# EAGLE schematic EEZ DIB DCP405 r1B1 (EAGLE 7.2.0)
Assembly variants: Farnell, TME

## Sheet 1 of 6: Power pre-regulator
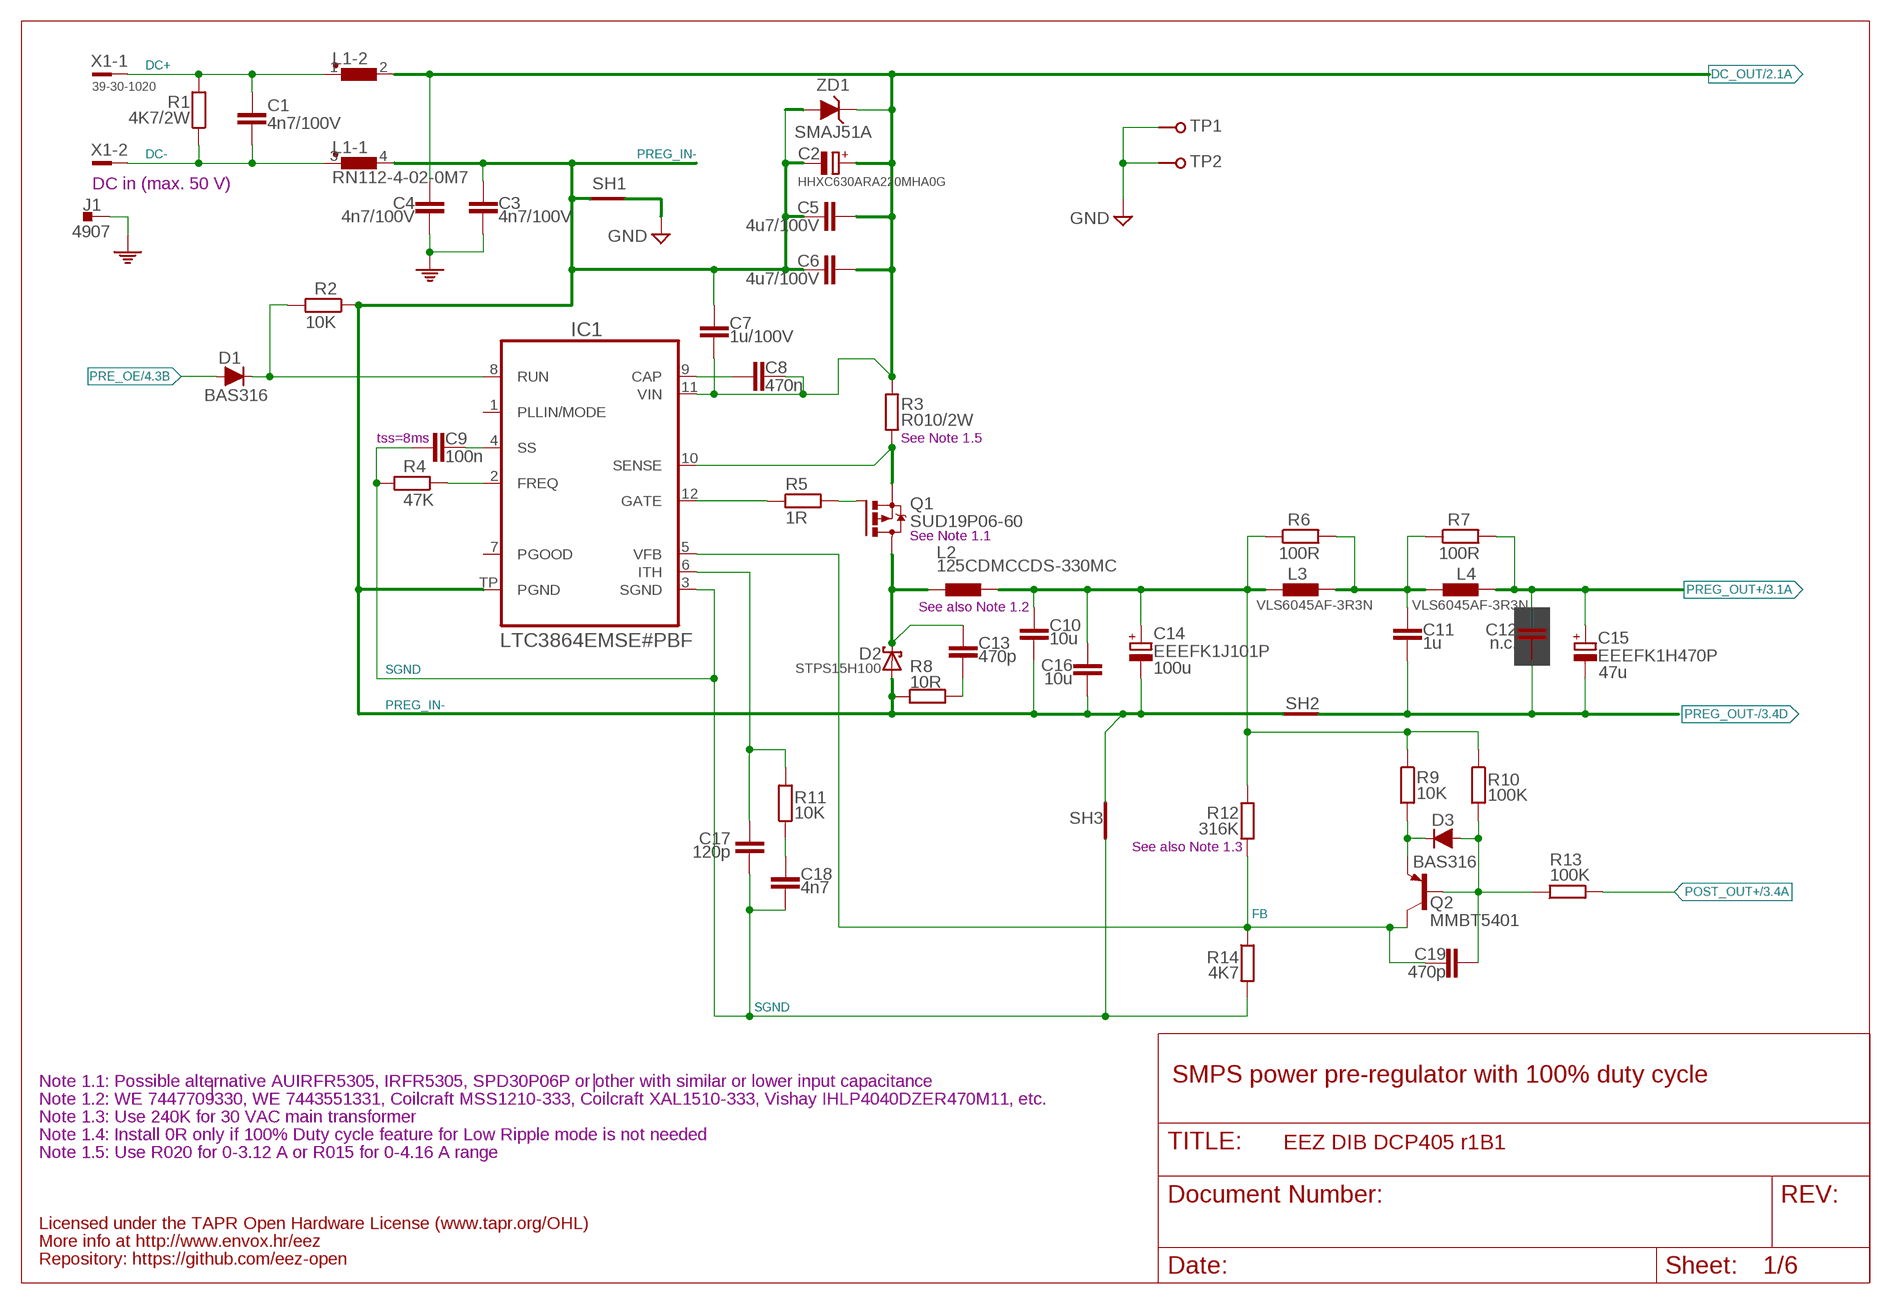
[diagram p0: schematic, sheet 1]

### Parts
C1  4n7/100V  C-EUC1206  [C1206]
C2  HHXC630ARA220MHA0G  ECAPSMD8.3MM/HA0  [CAPAE830X1050N]
C3  4n7/100V  C-EUC1206  [C1206]
C4  4n7/100V  C-EUC1206  [C1206]
C5  4u7/100V  C-EUC1210  [C1210]
C6  4u7/100V  C-EUC1210  [C1210]
C7  1u/100V  C-EUC1206  [C1206]
C8  470n  C-EUC0805  [C0805]
C9  100n  C-EUC0603  [C0603]
C10  10u  C-EUC1210  [C1210]
C11  1u  C-EUC0805  [C0805]
C12  n.c.  C-EUC0805  [C0805]
C13  470p  C-EUC0805  [C0805]
C14  EEEFK1J101P  ECAP10X10  [CAPAE1030X1050N]
C15  EEEFK1H470P  ECAPSMD8.3MM/HA0  [CAPAE830X1050N]
C16  10u  C-EUC1210  [C1210]
C17  120p  C-EUC0805  [C0805]
C18  4n7  C-EUC0805  [C0805]
C19  470p  C-EUC0805  [C0805]
D1  BAS316  DIODESOD323R  [SOD323-R]
D2  STPS15H100  SCHOTTKY-DUAL_A_L  [TO252-L]
D3  BAS316  DIODESOD323R  [SOD323-R]
IC1  LTC3864EMSE#PBF  LTC3864  [LTC_05-08-1666]
J1  4907  PCB_TAB-4907  [PCB_TAB-4907]
L1  RN112-4-02-0M7  RN112  [RN112]
L2  125CDMCCDS-330MC  125CDMCC/DS  [125CDMCC/DS]
L3  VLS6045AF-3R3N  COILCRAFT_HPI0630  [COILCRAFT_HPI0630]
L4  VLS6045AF-3R3N  COILCRAFT_HPI0630  [COILCRAFT_HPI0630]
Q1  SUD19P06-60  P-MOSFETDPAK  [TO229P990X239-3N]
Q2  MMBT5401  BC857B-PNP-SOT23-BEC  [SOT23-BEC]
R1  4K7/2W  R-EU_R2512  [R2512]
R2  10K  R-EU_R0805  [R0805]
R3  R010/2W  R-EU_R2512  [R2512]
R4  47K  R-EU_R0805  [R0805]
R5  1R  R-EU_R0805  [R0805]
R6  100R  R-EU_R0805  [R0805]
R7  100R  R-EU_R0805  [R0805]
R8  10R  R-EU_R1206  [R1206]
R9  10K  R-EU_R0805  [R0805]
R10  100K  R-EU_R0805  [R0805]
R11  10K  R-EU_R0805  [R0805]
R12  316K  R-EU_R0805  [R0805]
R13  100K  R-EU_R0805  [R0805]
R14  4K7  R-EU_R0805  [R0805]
SH1  SHORTNOHOLE  [SHORT_NOHOLE]
SH2  Pgnd to Pout- short  SHORTNOHOLE  [SHORT_NOHOLE]
SH3  Sgnd to Pgnd short  SHORTNOHOLE  [SHORT_NOHOLE]
TP1  PCB_TEST_TABSHIELD  [PCB_SHIELD_TAB]
TP2  PCB_TEST_TABSHIELD  [PCB_SHIELD_TAB]
X1  39-30-1020  MINIFIT_39301020  [MINIFIT_39301020]
ZD1  SMAJ51A  P6SMB68A  [DO214AA]

### Nets
DC+: C1.2 L1.1 R1.2 X1.1
DC-: C1.1 L1.3 R1.1 X1.2
DC_OUT: C2.+ C4.2 C5.1 C6.1 C7.1 C8.2 IC1.11(VIN) L1.2 R3.1 ZD1.C ; also sheet 2,3
FB: C19.1 IC1.5(VFB) Q2.C R12.2 R14.1
GND: SH1.2(GND_B) TP1.1 TP2.1 ; also sheet 2,3,4,5,6
L_OUT: C10.1 C14.+ C16.1 L2.2 L3.1 R6.1 R9.1 R10.1 R12.1
N$1: D3.C Q2.E R9.2
N$2: C18.1 R11.1
N$7: D1.C IC1.8(RUN) R2.2
N$8: C17.1 IC1.6(ITH) R11.2
N$23: C8.1 IC1.9(CAP)
N$24: IC1.2(FREQ) R4.1
N$27: C9.2 IC1.4(SS)
N$28: Q1.1(G) R5.2
N$30: IC1.12(GATE) R5.1
N$35: C11.1 L3.2 L4.1 R6.2 R7.1
N$38: C13.2 R8.2
N$79: C19.2 D3.A Q2.B R10.2 R13.1
PE: C3.2 C4.1 J1.1 J1.2 ; also sheet 6
POST_OUT+: R13.2 ; also sheet 3,6
PRE_OE: D1.A ; also sheet 4
PREG_IN-: C2.- C3.1 C5.2 C6.2 C7.2 C10.2 C14.- C16.2 D2.1(A) D2.2(A) IC1.TP(PGND) L1.4 R2.1 R8.1 SH1.1(GND_A) SH2.2(GND_B) SH3.2(GND_B) ZD1.A
PREG_OUT+: C12.1 C15.+ L4.2 R7.2 ; also sheet 3
PREG_OUT-: C11.2 C12.2 C15.- SH2.1(GND_A) ; also sheet 3,5
SENSE: IC1.10(SENSE) Q1.3(S) R3.2
SGND: C9.1 C17.2 C18.2 IC1.3(SGND) R4.2 R14.2 SH3.1(GND_A)
SW: C13.1 D2.3(C) L2.1 Q1.2(D)
Unconnected: IC1.1(PLLIN/MODE) IC1.7(PGOOD)

### Notes on the sheet
- DC in (max. 50 V)
- tss=8ms | See Note 1.5
- See Note 1.1
- See also Note 1.2
- 100u | 47u
- See also Note 1.3
- Note 1.1: Possible alternative AUIRFR5305, IRFR5305, SPD30P06P or other with similar or lower input capacitance | SMPS power pre-regulator with 100% duty cycle
- Note 1.2: WE 7447709330, WE 7443551331, Coilcraft MSS1210-333, Coilcraft XAL1510-333, Vishay IHLP4040DZER470M11, etc.
- Note 1.3: Use 240K for 30 VAC main transformer
- Note 1.4: Install 0R only if 100% Duty cycle feature for Low Ripple mode is not needed
- Note 1.5: Use R020 for 0-3.12 A or R015 for 0-4.16 A range
- Licensed under the TAPR Open Hardware License (www.tapr.org/OHL)
- More info at http://www.envox.hr/eez
- Repository: https://github.com/eez-open

## Sheet 2 of 6: Bias power, DIB interface
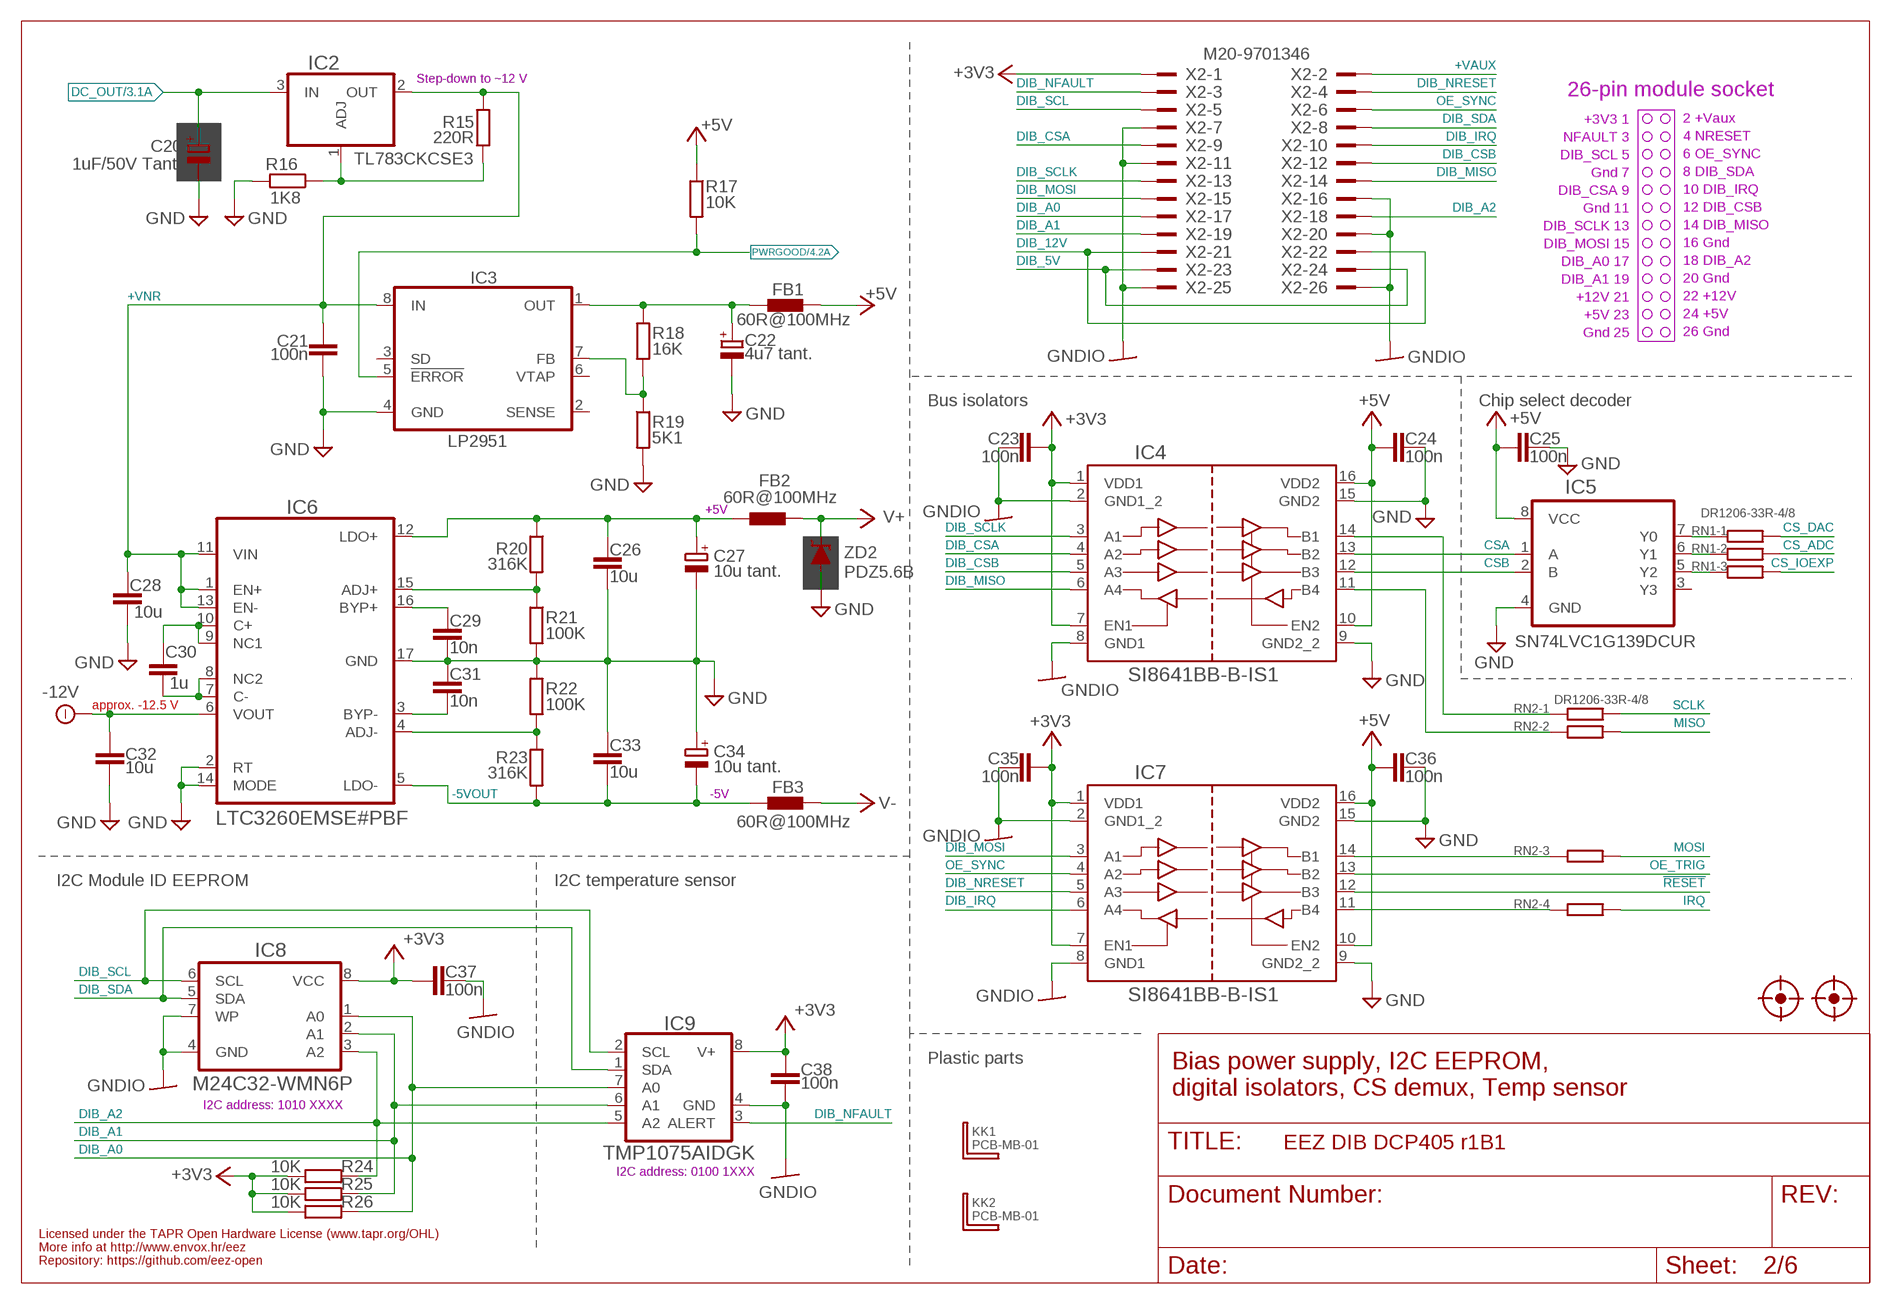
[diagram p1: schematic, sheet 2]

### Parts
C20  1uF/50V Tant.  CPOL-EUC/6032-28R  [C/6032-28R]
C21  100n  C-EUC0603  [C0603]
C22  4u7 tant.  ECAP1206  [EC1206]
C23  100n  C-EUC0603  [C0603]
C24  100n  C-EUC0603  [C0603]
C25  100n  C-EUC0603  [C0603]
C26  10u  C-EUC1210  [C1210]  (variant Farnell: 2320829)  (variant TME: CL21B225KAFNNNG )
C27  10u tant.  ECAP1206  [EC1206]
C28  10u  C-EUC1210  [C1210]
C29  10n  C-EUC0805  [C0805]
C30  1u  C-EUC0805  [C0805]
C31  10n  C-EUC0805  [C0805]
C32  10u  C-EUC1210  [C1210]
C33  10u  C-EUC1210  [C1210]
C34  10u tant.  ECAP1206  [EC1206]
C35  100n  C-EUC0603  [C0603]
C36  100n  C-EUC0603  [C0603]
C37  100n  C-EUC0603  [C0603]
C38  100n  C-EUC0603  [C0603]
FB1  60R@100MHz  FERRITE_BEAD0603  [BEAD0603]
FB2  60R@100MHz  FERRITE_BEAD0603  [BEAD0603]
FB3  60R@100MHz  FERRITE_BEAD0603  [BEAD0603]
FM1  FIDUCIAL_2  [FIDUCIAL_DUAL]
FM2  FIDUCIAL_2  [FIDUCIAL_DUAL]
IC2  TL783CKCSE3  [TO220H-CLR2]
IC3  LP2951  LP2951SO8  [SOIC127P600X175-8N]
IC4  SI8641BB-B-IS1  SI8641NSOIC-16  [SOIC-16]
IC5  SN74LVC1G139DCUR  SN74LVC1G139-VSSOP  [DCU8]
IC6  LTC3260EMSE#PBF  LTC3260MSOP16  [SOP50P490X110-17N]
IC7  SI8641BB-B-IS1  SI8641NSOIC-16  [SOIC-16]
IC8  M24C32-WMN6P  AT24CXXSOIC8  [SOIC127P600X173-8N]
IC9  TMP1075AIDGK  TMPX75DGK  [DGK8]
KK1  PCB-MB-01  PCB-MB  [PCB-MB]
KK2  PCB-MB-01  PCB-MB  [PCB-MB]
R15  220R  R-EU_R0805  [R0805]
R16  1K8  R-EU_R0805  [R0805]
R17  10K  R-EU_R0805  [R0805]
R18  16K  R-EU_R0805  [R0805]
R19  5K1  R-EU_R0805  [R0805]
R20  316K  R-EU_R0805  [R0805]
R21  100K  R-EU_R0805  [R0805]
R22  100K  R-EU_R0805  [R0805]
R23  316K  R-EU_R0805  [R0805]
R24  10K  R-EU_R0805  [R0805]
R25  10K  R-EU_R0805  [R0805]
R26  10K  R-EU_R0805  [R0805]
RN1  DR1206-33R-4/8  R_ARRAY4  [CAY16]
RN2  DR1206-33R-4/8  R_ARRAY4  [CAY16]
X2  M20-9701346  [M20-9701346]
ZD2  PDZ5.6B  ZENER-DIODESOD323  [SOD323-W]

### Nets
!RESET: IC7.12(B3) ; also sheet 4
+3V3: C23.1 C35.1 C37.2 C38.1 IC4.1(VDD1) IC4.7(EN1) IC7.1(VDD1) IC7.7(EN1) IC8.8(VCC) IC9.8(V+) R24.1 R25.1 R26.1 X2.1
+5V: C24.2 C25.1 C36.2 FB1.P$2 IC4.10(EN2) IC4.16(VDD2) IC5.8(VCC) IC7.10(EN2) IC7.16(VDD2) R17.1 ; also sheet 3,4,5,6
+5VOUT: C26.1 C27.+ FB2.P$1 IC6.12(LDO+) R20.1
+VAUX: X2.2
+VNR: C21.1 C28.1 IC2.2(OUT) IC3.8(IN) IC6.1(EN+) IC6.11(VIN) IC6.13(EN-) R15.1
-5VOUT: C33.2 C34.- FB3.P$1 IC6.5(LDO-) R23.2
-12V: C32.1 IC6.6(VOUT) ; also sheet 3
CS_ADC: RN1.7 ; also sheet 4
CS_DAC: RN1.8 ; also sheet 4
CS_IOEXP: RN1.6 ; also sheet 4
CSA: IC4.13(B2) IC5.1(A)
CSB: IC4.12(B3) IC5.2(B)
DC_OUT: C20.+ IC2.3(IN) ; also sheet 1,3
DIB_5V: X2.23 X2.24
DIB_12V: X2.21 X2.22
DIB_A0: IC8.1(A0) IC9.7(A0) R26.2 X2.17
DIB_A1: IC8.2(A1) IC9.6(A1) R25.2 X2.19
DIB_A2: IC8.3(A2) IC9.5(A2) R24.2 X2.18
DIB_CSA: IC4.4(A2) X2.9
DIB_CSB: IC4.5(A3) X2.12
DIB_IRQ: IC7.6(A4) X2.10
DIB_MISO: IC4.6(A4) X2.14
DIB_MOSI: IC7.3(A1) X2.15
DIB_NFAULT: IC9.3(ALERT) X2.3
DIB_NRESET: IC7.5(A3) X2.4
DIB_SCL: IC8.6(SCL) IC9.2(SCL) X2.5
DIB_SCLK: IC4.3(A1) X2.13
DIB_SDA: IC8.5(SDA) IC9.1(SDA) X2.8
GND: C20.- C21.2 C22.- C24.1 C25.2 C26.2 C27.- C28.2 C29.1 C31.1 C32.2 C33.1 C34.+ C36.1 IC3.4(GND) IC4.9(GND2_2) IC4.15(GND2) IC5.4(GND) IC6.2(RT) IC6.14(MODE) IC6.17(GND) IC7.9(GND2_2) IC7.15(GND2) R16.2 R19.2 R21.2 R22.1 ZD2.A ; also sheet 1,3,4,5,6
GNDIO: C23.2 C35.2 C37.1 C38.2 IC4.2(GND1_2) IC4.8(GND1) IC7.2(GND1_2) IC7.8(GND1) IC8.4(GND) IC8.7(WP) IC9.4(GND) X2.7 X2.11 X2.16 X2.20 X2.25 X2.26
IRQ: RN2.5 ; also sheet 4
MISO: RN2.7 ; also sheet 4
MOSI: RN2.6 ; also sheet 4
N$4: IC5.5(Y2) RN1.3
N$6: IC5.7(Y0) RN1.1
N$9: IC4.11(B4) RN2.2
N$10: IC7.11(B4) RN2.4
N$22: IC5.6(Y1) RN1.2
N$39: IC6.15(ADJ+) R20.2 R21.1
N$40: C30.1 IC6.9(NC1) IC6.10(C+)
N$43: C30.2 IC6.7(C-) IC6.8(NC2)
N$52: C29.2 IC6.16(BYP+)
N$57: IC6.4(ADJ-) R22.2 R23.1
N$58: C31.2 IC6.3(BYP-)
N$61: IC7.14(B1) RN2.3
N$63: IC3.7(FB) R18.2 R19.1
N$122: IC4.14(B1) RN2.1
N$167: C22.+ FB1.P$1 IC3.1(OUT) R18.1
OE_SYNC: IC7.4(A2) X2.6
OE_TRIG: IC7.13(B2) ; also sheet 4
PWRGOOD: IC3.5(!ERROR) R17.2 ; also sheet 4
SCLK: RN2.8 ; also sheet 4
TL783_ADJ: IC2.1(ADJ) R15.2 R16.1
V+: FB2.P$2 ZD2.C ; also sheet 3,4,5
V-: FB3.P$2 ; also sheet 3,5
Unconnected: IC3.2(SENSE) IC3.3(SD) IC3.6(VTAP) IC5.3(Y3) RN1.4 RN1.5

### Notes on the sheet
- Step-down to ~12 V
- 26-pin module socket
- +3V3 1
- 2 +Vaux
- NFAULT 3
- 4 NRESET
- DIB_SCL 5
- 6 OE_SYNC
- Gnd 7
- 8 DIB_SDA
- DIB_CSA 9
- 10 DIB_IRQ
- Gnd 11
- 12 DIB_CSB
- DIB_SCLK 13
- 14 DIB_MISO
- DIB_MOSI 15
- 16 Gnd
- DIB_A0 17
- 18 DIB_A2
- DIB_A1 19
- 20 Gnd
- +12V 21
- 22 +12V
- +5V 23
- 24 +5V
- Gnd 25
- 26 Gnd
- Bus isolators | Chip select decoder
- +5V
- approx. -12.5 V
- -5V
- I2C Module ID EEPROM | I2C temperature sensor
- Plastic parts
- Bias power supply, I2C EEPROM,
  digital isolators, CS demux, Temp sensor
- I2C address: 1010 XXXX
- I2C address: 0100 1XXX
- Licensed under the TAPR Open Hardware License (www.tapr.org/OHL)
- More info at http://www.envox.hr/eez
- Repository: https://github.com/eez-open

## Sheet 3 of 6: Post-regulator
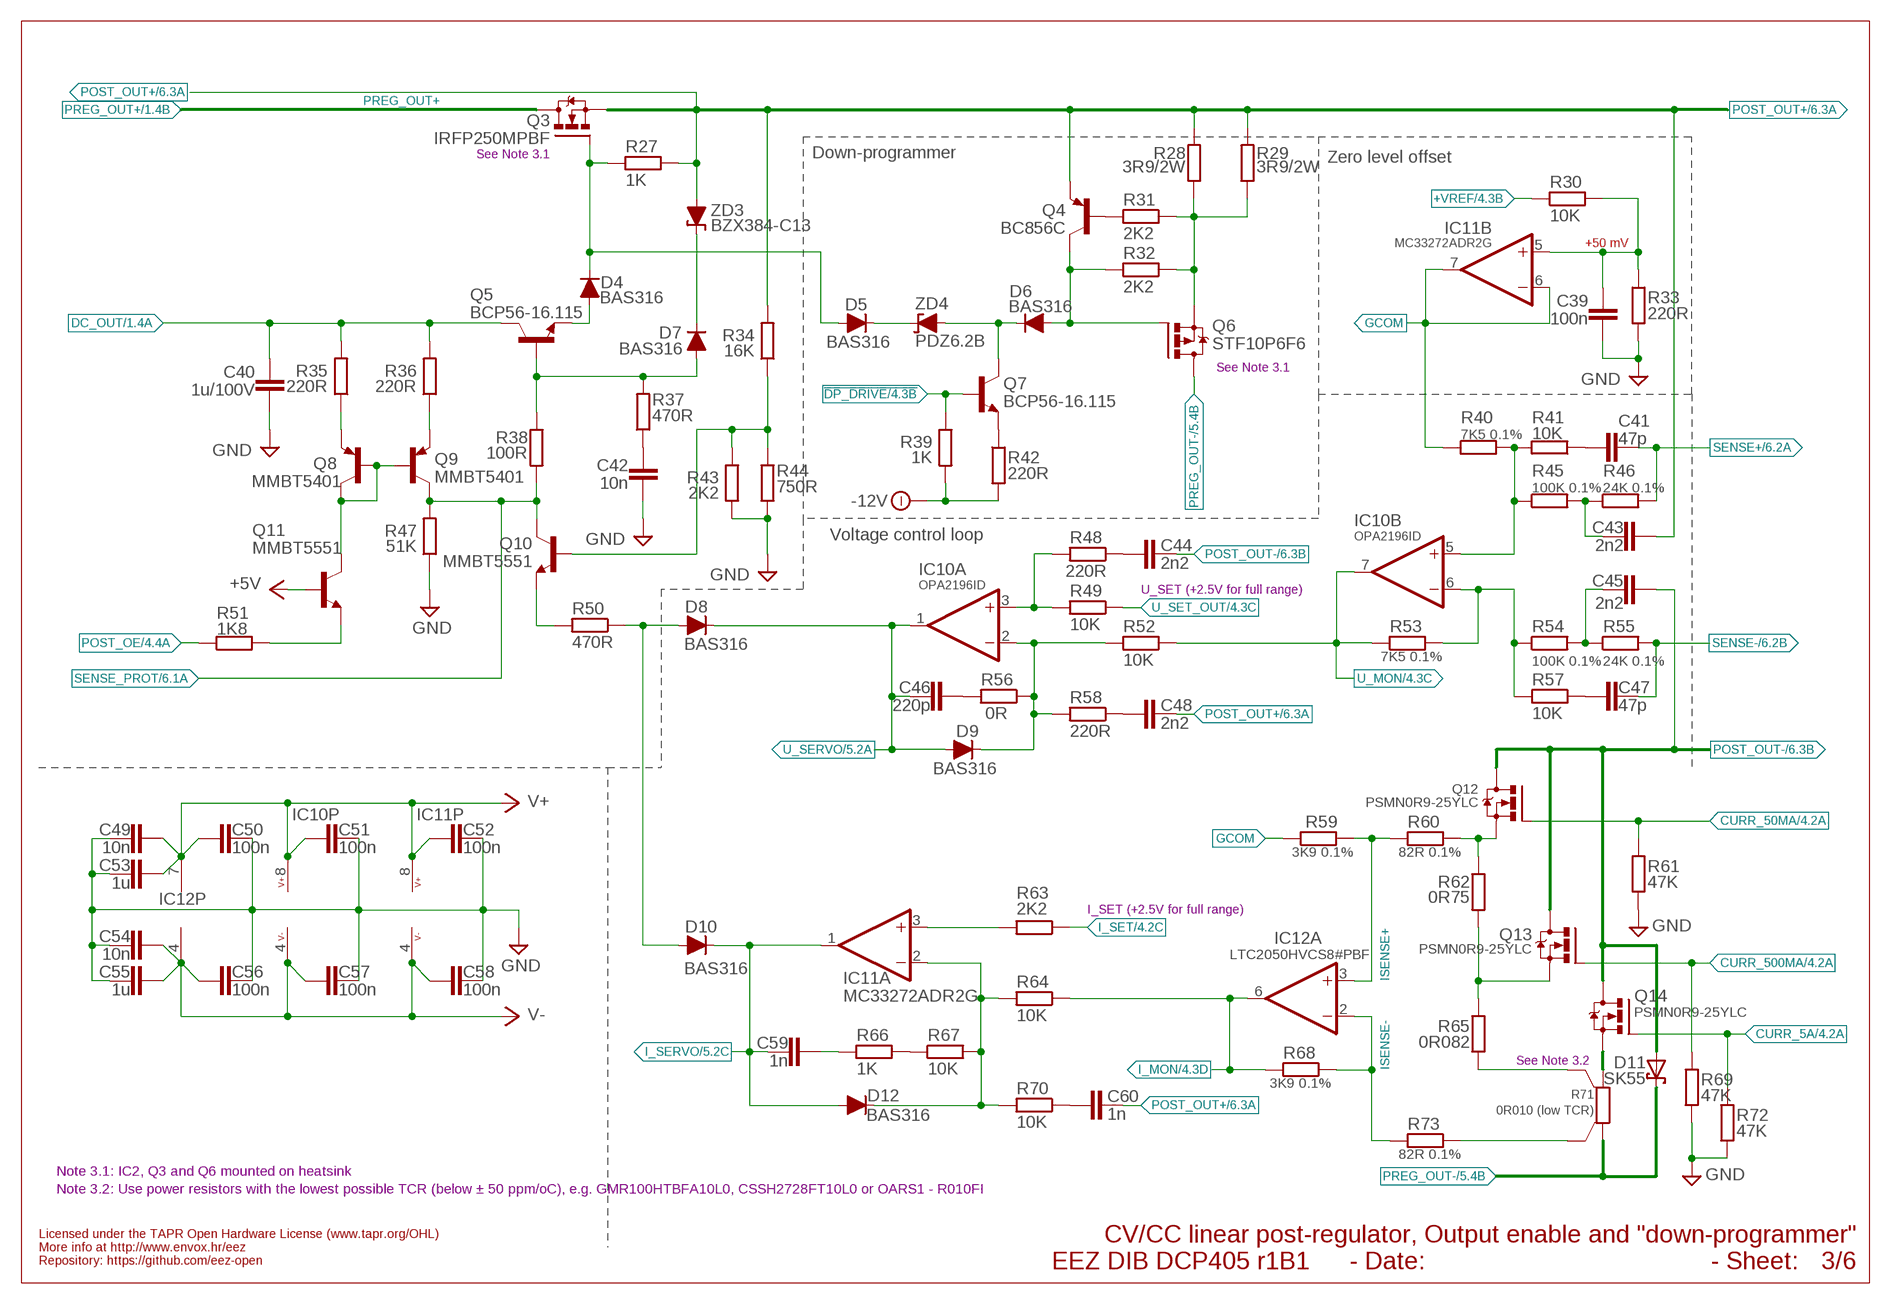
[diagram p2: schematic, sheet 3]

### Parts
C39  100n  C-EUC0603  [C0603]
C40  1u/100V  C-EUC1206  [C1206]
C41  47p  C-EUC0805  [C0805]
C42  10n  C-EUC0805  [C0805]
C43  2n2  C-EUC0805  [C0805]
C44  2n2  C-EUC0805  [C0805]
C45  2n2  C-EUC0805  [C0805]
C46  220p  C-EUC0805  [C0805]
C47  47p  C-EUC0805  [C0805]
C48  2n2  C-EUC0805  [C0805]
C49  10n  C-EUC0805  [C0805]
C50  100n  C-EUC0603  [C0603]
C51  100n  C-EUC0603  [C0603]
C52  100n  C-EUC0603  [C0603]
C53  1u  C-EUC0805  [C0805]
C54  10n  C-EUC0805  [C0805]
C55  1u  C-EUC0805  [C0805]
C56  100n  C-EUC0603  [C0603]
C57  100n  C-EUC0603  [C0603]
C58  100n  C-EUC0603  [C0603]
C59  1n  C-EUC0805  [C0805]
C60  1n  C-EUC0805  [C0805]
D4  BAS316  DIODESOD323R  [SOD323-R]
D5  BAS316  DIODESOD323R  [SOD323-R]
D6  BAS316  DIODESOD323R  [SOD323-R]
D7  BAS316  DIODESOD323R  [SOD323-R]
D8  BAS316  DIODESOD323R  [SOD323-R]
D9  BAS316  DIODESOD323R  [SOD323-R]
D10  BAS316  DIODESOD323R  [SOD323-R]
D11  SK55  SCHOTTKYSMB  [SMB]
D12  BAS316  DIODESOD323R  [SOD323-R]
IC10  OPA2196ID  TL072SOIC8  [SOIC127P600X173-8N]
IC11  MC33272ADR2G  TL072SOIC8  [SOIC127P600X173-8N]
IC12  LTC2050HVCS8#PBF  OP27GSZSO8  [SOIC127P600X173-8N]
Q3  IRFP250MPBF  IRFP240MIRROR2  [TO247BH-CLR2]
Q4  BC856C  BC857C-PNP-SOT23-BEC  [SOT23-BEC]
Q5  BCP56-16.115  BCP56  [SOT230P700X180-4N]
Q6  STF10P6F6  P-MOSFETMIRROR2  [TO220H-CLR2]
Q7  BCP56-16.115  BCP56  [SOT230P700X180-4N]
Q8  MMBT5401  BC857B-PNP-SOT23-BEC  [SOT23-BEC]
Q9  MMBT5401  BC857B-PNP-SOT23-BEC  [SOT23-BEC]
Q10  MMBT5551  MMBT5551LT1-NPN-SOT23-BEC  [SOT23-BEC]
Q11  MMBT5551  MMBT5551LT1-NPN-SOT23-BEC  [SOT23-BEC]
Q12  PSMN0R9-25YLC  N-MOSFETLFPAK  [SOT669]
Q13  PSMN0R9-25YLC  N-MOSFETLFPAK  [SOT669]
Q14  PSMN0R9-25YLC  N-MOSFETLFPAK  [SOT669]
R27  1K  R-EU_R0805  [R0805]
R28  3R9/2W  R-EU_R2512  [R2512]
R29  3R9/2W  R-EU_R2512  [R2512]
R30  10K  R-EU_R0805  [R0805]
R31  2K2  R-EU_R0805  [R0805]
R32  2K2  R-EU_R0805  [R0805]
R33  220R  R-EU_R0805  [R0805]
R34  16K  R-EU_R0805  [R0805]
R35  220R  R-EU_R0805  [R0805]
R36  220R  R-EU_R0805  [R0805]
R37  470R  R-EU_R0805  [R0805]
R38  100R  R-EU_R0805  [R0805]
R39  1K  R-EU_R0805  [R0805]
R40  7K5 0.1%  R-EU_R0805  [R0805]
R41  10K  R-EU_R0805  [R0805]
R42  220R  R-EU_R0805  [R0805]
R43  2K2  R-EU_R0805  [R0805]
R44  750R  R-EU_R0805  [R0805]
R45  100K 0.1%  R-EU_R0805  [R0805]
R46  24K 0.1%  R-EU_R0805  [R0805]
R47  51K  R-EU_R0805  [R0805]
R48  220R  R-EU_R0805  [R0805]
R49  10K  R-EU_R0805  [R0805]
R50  470R  R-EU_R0805  [R0805]
R51  1K8  R-EU_R0805  [R0805]
R52  10K  R-EU_R0805  [R0805]
R53  7K5 0.1%  R-EU_R0805  [R0805]
R54  100K 0.1%  R-EU_R0805  [R0805]
R55  24K 0.1%  R-EU_R0805  [R0805]
R56  0R  R-EU_R0805  [R0805]
R57  10K  R-EU_R0805  [R0805]
R58  220R  R-EU_R0805  [R0805]
R59  3K9 0.1%  R-EU_R0805  [R0805]
R60  82R 0.1%  R-EU_R0805  [R0805]
R61  47K  R-EU_R0805  [R0805]
R62  0R75  R-EU_R1206  [R1206]
R63  2K2  R-EU_R0805  [R0805]
R64  10K  R-EU_R0805  [R0805]
R65  0R082  R-EU_R1210  [R1210]
R66  1K  R-EU_R0805  [R0805]
R67  10K  R-EU_R0805  [R0805]
R68  3K9 0.1%  R-EU_R0805  [R0805]
R69  47K  R-EU_R0805  [R0805]
R70  10K  R-EU_R0805  [R0805]
R71  0R010 (low TCR)  R-EU_4WIREH2728  [R_H2728]
R72  47K  R-EU_R0805  [R0805]
R73  82R 0.1%  R-EU_R0805  [R0805]
ZD3  BZX384-C13  ZENER-DIODESOD323  [SOD323-W]
ZD4  PDZ6.2B  ZENER-DIODESOD323  [SOD323-W]

### Nets
5A_S: Q14.1(S) Q14.2(S) Q14.3(S) R71.2
50MA_S: Q12.1(S) Q12.2(S) Q12.3(S) R60.1 R62.1
500MA_S: Q13.1(S) Q13.2(S) Q13.3(S) R62.2 R65.2
!DP_DRIVE: Q7.1(B) R39.1 ; also sheet 4
+5V: Q11.B ; also sheet 2,4,5,6
+VREF: R30.1 ; also sheet 4
-12V: R39.2 R42.2 ; also sheet 2
CURR_5A: Q14.4(G) R72.2 ; also sheet 4
CURR_50MA: Q12.4(G) R61.2 ; also sheet 4
CURR_500MA: Q13.4(G) R69.2 ; also sheet 4
DC_OUT: C40.1 Q5.2(C) Q5.4(C) R35.2 R36.2 ; also sheet 1,2
DP_S: Q6.3(S) R28.1 R29.1 R31.1 R32.1
GCOM: IC11.6(B:-IN) IC11.7(B:OUT) R40.1 R59.1
GND: C39.2 C40.2 C42.2 C49.1 C50.2 C51.1 C52.1 C53.1 C54.1 C55.1 C56.2 C57.1 C58.1 R33.2 R43.1 R44.1 R47.1 R61.1 R69.1 R72.1 ; also sheet 1,2,4,5,6
I_MON: IC12.6(A:OUT) R64.1 R68.2 ; also sheet 4
I_SERVO: C59.2 D10.C D12.A IC11.1(A:OUT) ; also sheet 5
I_SET: R63.1 ; also sheet 4
ISENSE+: IC12.3(A:+IN) R59.2 R60.2
ISENSE-: IC12.2(A:-IN) R68.1 R73.2
LOOP_CTRL: D8.A D10.A R50.1
N$11: R65.1 R71.2S
N$14: C46.1 R56.2
N$82: IC11.3(A:+IN) R63.2
N$83: IC10.3(A:+IN) R48.2 R49.2
N$84: D9.C IC10.2(A:-IN) R52.2 R56.1 R58.2
N$85: C45.1 R54.2 R55.1
N$86: C41.2 R41.1
N$87: C47.2 R57.1
N$88: C60.2 R70.1
N$89: D12.C IC11.2(A:-IN) R64.2 R67.2 R70.2
N$90: C44.2 R48.1
N$91: C48.2 R58.1
N$92: D4.C D5.A Q3.1(G) R27.1
N$93: D4.A Q5.3(E)
N$95: D7.A Q5.1(B) R37.2 R38.1
N$96: C42.1 R37.1
N$97: Q10.B R34.1 R43.2 R44.2
N$98: Q7.3(E) R42.1
N$99: Q4.B R31.2
N$102: C39.1 IC11.5(B:+IN) R30.2 R33.1
N$117: C43.1 R45.2 R46.1
N$129: D7.C ZD3.C
N$143: D5.C ZD4.C
N$145: Q10.E R50.2
N$147: D6.A Q4.C Q6.1(G) R32.2
N$150: IC10.5(B:+IN) R40.2 R41.2 R45.1
N$158: IC10.6(B:-IN) R53.2 R54.1 R57.2
N$160: R66.2 R67.1
N$162: C59.1 R66.1
N$183: Q9.E R36.1
N$184: Q8.E R35.1
N$186: Q11.E R51.2
N$200: R71.1S R73.1
POST_OE: R51.1 ; also sheet 4
POST_OUT+: C43.2 C48.1 C60.1 Q3.3(S) Q4.E R27.2 R28.2 R29.2 R34.2 ZD3.A ; also sheet 1,6
POST_OUT-: C44.1 C45.2 D11.A Q12.MB(D) Q13.MB(D) Q14.MB(D) ; also sheet 6
PREG_OUT+: Q3.2(D) ; also sheet 1
PREG_OUT-: D11.C Q6.2(D) R71.1 ; also sheet 1,5
Q6C: D6.C Q7.2(C) Q7.4(C) ZD4.A
Q7C: Q8.B Q8.C Q9.B Q11.C
SENSE+: C41.1 R46.2 ; also sheet 6
SENSE-: C47.1 R55.2 ; also sheet 6
SENSE_PROT: Q9.C Q10.C R38.2 R47.2 ; also sheet 6
U_MON: IC10.7(B:OUT) R52.1 R53.1 ; also sheet 4,5
U_SERVO: C46.2 D8.C D9.A IC10.1(A:OUT) ; also sheet 5
U_SET_OUT: R49.1 ; also sheet 4
V+: C49.2 C50.1 C51.2 C52.2 C53.2 IC10.8(P:V+) IC11.8(P:V+) IC12.7(P:V+) ; also sheet 2,4,5
V-: C54.2 C55.2 C56.1 C57.2 C58.2 IC10.4(P:V-) IC11.4(P:V-) IC12.4(P:V-) ; also sheet 2,5

### Notes on the sheet
- See Note 3.1
- Down-programmer | Zero level offset
- +50 mV
- See Note 3.1
- Voltage control loop
- U_SET (+2.5V for full range)
- I_SET (+2.5V for full range)
- See Note 3.2
- Note 3.1: IC2, Q3 and Q6 mounted on heatsink
- Note 3.2: Use power resistors with the lowest possible TCR (below ± 50 ppm/oC), e.g. GMR100HTBFA10L0, CSSH2728FT10L0 or OARS1 - R010FI
- Licensed under the TAPR Open Hardware License (www.tapr.org/OHL)
- CV/CC linear post-regulator, Output enable and "down-programmer"
- More info at http://www.envox.hr/eez
- Repository: https://github.com/eez-open
- - Date: | - Sheet:

## Sheet 4 of 6: Digital control, Vref
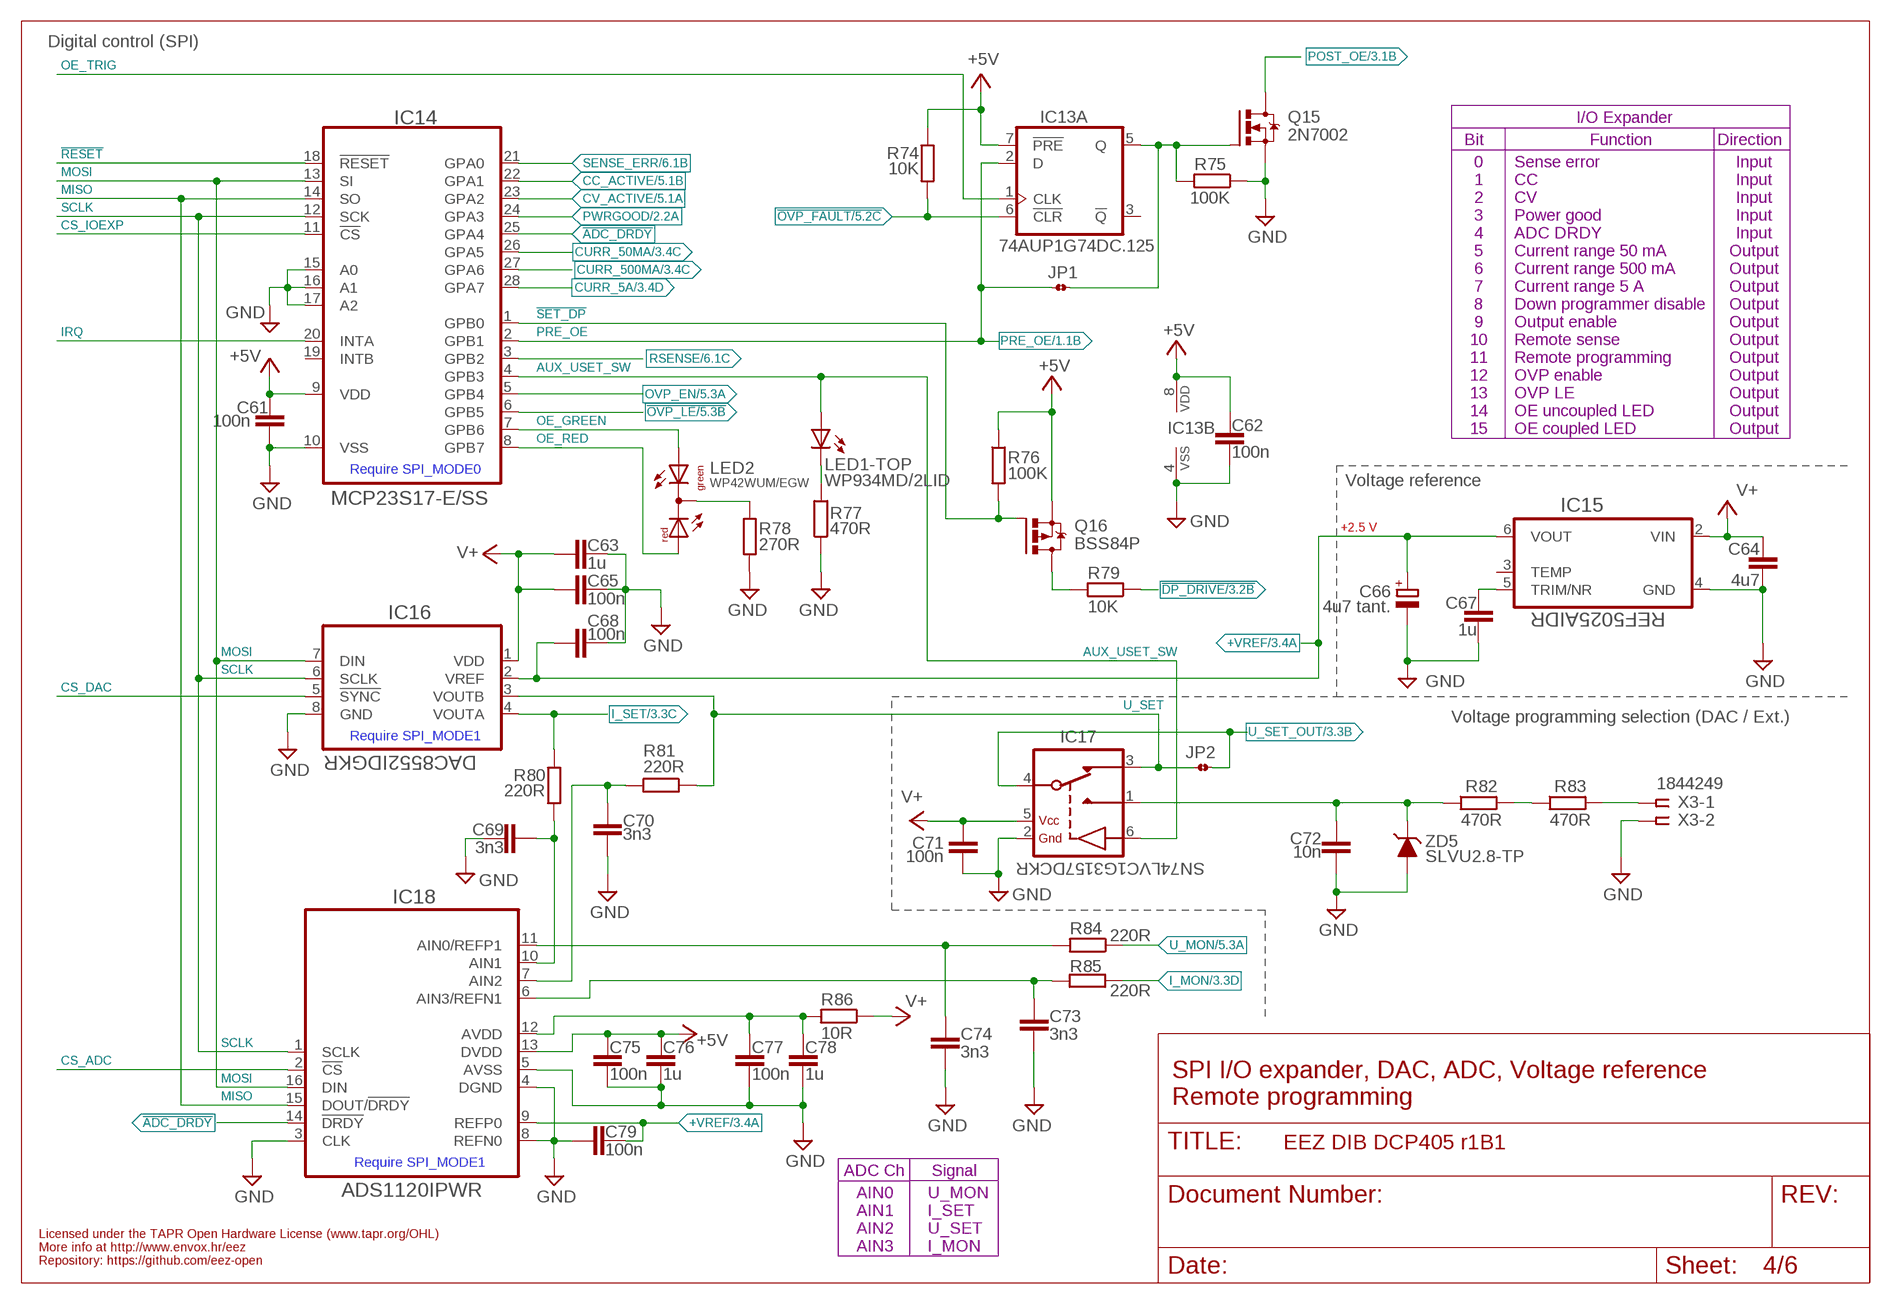
[diagram p3: schematic, sheet 4]

### Parts
C61  100n  C-EUC0603  [C0603]
C62  100n  C-EUC0603  [C0603]
C63  1u  C-EUC0805  [C0805]
C64  4u7  C-EUC1206  [C1206]
C65  100n  C-EUC0603  [C0603]
C66  4u7 tant.  ECAP1206  [EC1206]
C67  1u  C-EUC0805  [C0805]
C68  100n  C-EUC0603  [C0603]
C69  3n3  C-EUC0805  [C0805]
C70  3n3  C-EUC0805  [C0805]
C71  100n  C-EUC0603  [C0603]
C72  10n  C-EUC0805  [C0805]
C73  3n3  C-EUC0805  [C0805]
C74  3n3  C-EUC0805  [C0805]
C75  100n  C-EUC0603  [C0603]
C76  1u  C-EUC0805  [C0805]
C77  100n  C-EUC0603  [C0603]
C78  1u  C-EUC0805  [C0805]
C79  100n  C-EUC0603  [C0603]
IC13  74AUP1G74DC.125  SN74LVC1G74DCTR-VSSOP  [DCU8]
IC14  MCP23S17-E/SS  MCP23S17-E/SSSSOP  [SOP65P780X200-28N]
IC15  REF5025AIDR  REF50XX  [SOIC127P600X175-8N]
IC16  DAC8552IDGKR  DAC8552_DGK_8M  [DGK8-M]
IC17  SN74LVC1G3157DCKR  SN74LVC1G3157-DCK  [SOT65P210X110-6N]
IC18  ADS1120IPWR  ADS1120TSSOP-16  [PW(R-PDSO-G16)]
JP1  JP2-CUT  [JP2-CUT]
JP2  JP2-CUT  [JP2-CUT]
LED1  WP934MD/2LID  [WP934MD]
LED2  WP42WUM/EGW  LED_L-42WUM/1EGWT  [L-42WUM-1EGWT]
Q15  2N7002  [SOT103P240X110-3N]
Q16  BSS84P  IRLML2246TRPBF  [SOT95P237X112-3N]
R74  10K  R-EU_R0805  [R0805]
R75  100K  R-EU_R0805  [R0805]
R76  100K  R-EU_R0805  [R0805]
R77  470R  R-EU_R0805  [R0805]
R78  270R  R-EU_R0805  [R0805]
R79  10K  R-EU_R0805  [R0805]
R80  220R  R-EU_R0805  [R0805]
R81  220R  R-EU_R0805  [R0805]
R82  470R  R-EU_R0805  [R0805]
R83  470R  R-EU_R0805  [R0805]
R84  220R  R-EU_R0805  [R0805]
R85  220R  R-EU_R0805  [R0805]
R86  10R  R-EU_R1206  [R1206]
X3  1844249  MC1,5/5-G-3,5  [MC1,5/5-G-3,5]
ZD5  SLVU2.8-TP  SLVU2.8  [SOT23]

### Nets
!ADC_DRDY: IC14.25(GPA4) IC18.14(!DRDY)
!DP_DRIVE: R79.1 ; also sheet 3
!OVP_FAULT: IC13.6(A:!CLR) R74.2 ; also sheet 5
!OVP_LE: IC14.6(GPB5) ; also sheet 5
!RESET: IC14.18(!RESET) ; also sheet 2
!SET_DP: IC14.1(GPB0) Q16.1(G) R76.2
+5V: C61.1 C62.2 C75.2 C76.2 IC13.7(A:!PRE) IC13.8(B:VDD) IC14.9(VDD) IC18.13(DVDD) Q16.2(S) R74.1 R76.1 ; also sheet 2,3,5,6
+VREF: C66.+ C68.2 C79.2 IC15.6(VOUT) IC16.2(VREF) IC18.9(REFP0) ; also sheet 3
AUX_IN: C72.2 IC17.1(NO) R82.1 ZD5.3(C)
AUX_USET_SW: IC14.4(GPB3) IC17.6(CTRL) LED1.TA(-TOP:A)
CC_ACTIVE: IC14.22(GPA1) ; also sheet 5
CS_ADC: IC18.2(!CS) ; also sheet 2
CS_DAC: IC16.5(!SYNC) ; also sheet 2
CS_IOEXP: IC14.11(!CS) ; also sheet 2
CURR_5A: IC14.28(GPA7) ; also sheet 3
CURR_50MA: IC14.26(GPA5) ; also sheet 3
CURR_500MA: IC14.27(GPA6) ; also sheet 3
CV_ACTIVE: IC14.23(GPA2) ; also sheet 5
DP_LED: Q16.3(D) R79.2
GND: C61.2 C62.1 C63.2 C64.2 C65.1 C66.- C67.2 C68.1 C69.1 C70.1 C71.2 C72.1 C73.2 C74.1 C75.1 C76.1 C77.1 C78.1 C79.1 IC13.4(B:VSS) IC14.10(VSS) IC14.15(A0) IC14.16(A1) IC14.17(A2) IC15.4(GND) IC16.8(GND) IC17.2(GND) IC18.3(CLK) IC18.4(DGND) IC18.5(AVSS) IC18.8(REFN0) Q15.2(S) R75.1 R77.1 R78.2 X3.2 ZD5.1(A) ZD5.2(A) ; also sheet 1,2,3,5,6
I_MON: R85.1 ; also sheet 3
I_SET: IC16.4(VOUTA) R80.1 ; also sheet 3
IRQ: IC14.20(INTA) ; also sheet 2
MISO: IC14.14(SO) IC18.15(DOUT/!DRDY) ; also sheet 2
MOSI: IC14.13(SI) IC16.7(DIN) IC18.16(DIN) ; also sheet 2
N$12: LED2.CC(C) R78.1
N$17: R82.2 R83.1
N$32: R83.2 X3.1
N$45: IC13.5(A:Q) JP1.2 Q15.1(G) R75.2
N$70: C77.2 C78.2 IC18.12(AVDD) R86.2
N$71: C67.1 IC15.5(TRIM/NR)
N$72: C69.2 IC18.10(AIN1) R80.2
N$73: C74.2 IC18.11(AIN0/REFP1) R84.2
N$80: C70.2 IC18.7(AIN2) R81.2
N$81: C73.1 IC18.6(AIN3/REFN1) R85.2
N$121: LED1.TC(-TOP:C) R77.2
OE_GREEN: IC14.7(GPB6) LED2.GREEN(AG)
OE_RED: IC14.8(GPB7) LED2.RED(AR)
OE_TRIG: IC13.1(A:CLK) ; also sheet 2
OVP_EN: IC14.5(GPB4) ; also sheet 5
POST_OE: Q15.3(D) ; also sheet 3
PRE_OE: IC13.2(A:D) IC14.2(GPB1) JP1.1 ; also sheet 1
PWRGOOD: IC14.24(GPA3) ; also sheet 2
RSENSE: IC14.3(GPB2) ; also sheet 6
SCLK: IC14.12(SCK) IC16.6(SCLK) IC18.1(SCLK) ; also sheet 2
SENSE_ERR: IC14.21(GPA0) ; also sheet 6
U_MON: R84.1 ; also sheet 3,5
U_SET: IC16.3(VOUTB) IC17.3(NC) JP2.1 R81.1 ; also sheet 5
U_SET_OUT: IC17.4(COM) JP2.2 ; also sheet 3
V+: C63.1 C64.1 C65.2 C71.1 IC15.2(VIN) IC16.1(VDD) IC17.5(VDD) R86.1 ; also sheet 2,3,5
Unconnected: IC13.3(A:!Q) IC14.19(INTB) IC15.3(TEMP)

### Notes on the sheet
- Digital control (SPI)
- I/O Expander
- Bit | Function | Direction
- 0 | Sense error | Input
- 1 | CC | Input
- 2 | CV | Input
- 3 | Power good | Input
- 4 | ADC DRDY | Input
- 5 | Current range 50 mA | Output
- 6 | Current range 500 mA | Output
- 7 | Current range 5 A | Output
- 8 | Down programmer disable | Output
- 9 | Output enable | Output
- 10 | Remote sense | Output
- 11 | Remote programming | Output
- 12 | OVP enable | Output
- 13 | OVP LE | Output
- 14 | OE uncoupled LED | Output
- 15 | OE coupled LED | Output
- Require SPI_MODE0 | Voltage reference
- +2.5 V
- Voltage programming selection (DAC / Ext.)
- Require SPI_MODE1
- SPI I/O expander, DAC, ADC, Voltage reference
- Remote programming
- Require SPI_MODE1
- ADC Ch | Signal
- AIN0 | U_MON
- AIN1 | I_SET
- AIN2 | U_SET
- Licensed under the TAPR Open Hardware License (www.tapr.org/OHL)
- More info at http://www.envox.hr/eez | AIN3 | I_MON
- Repository: https://github.com/eez-open

## Sheet 5 of 6: CC/CV, OVP
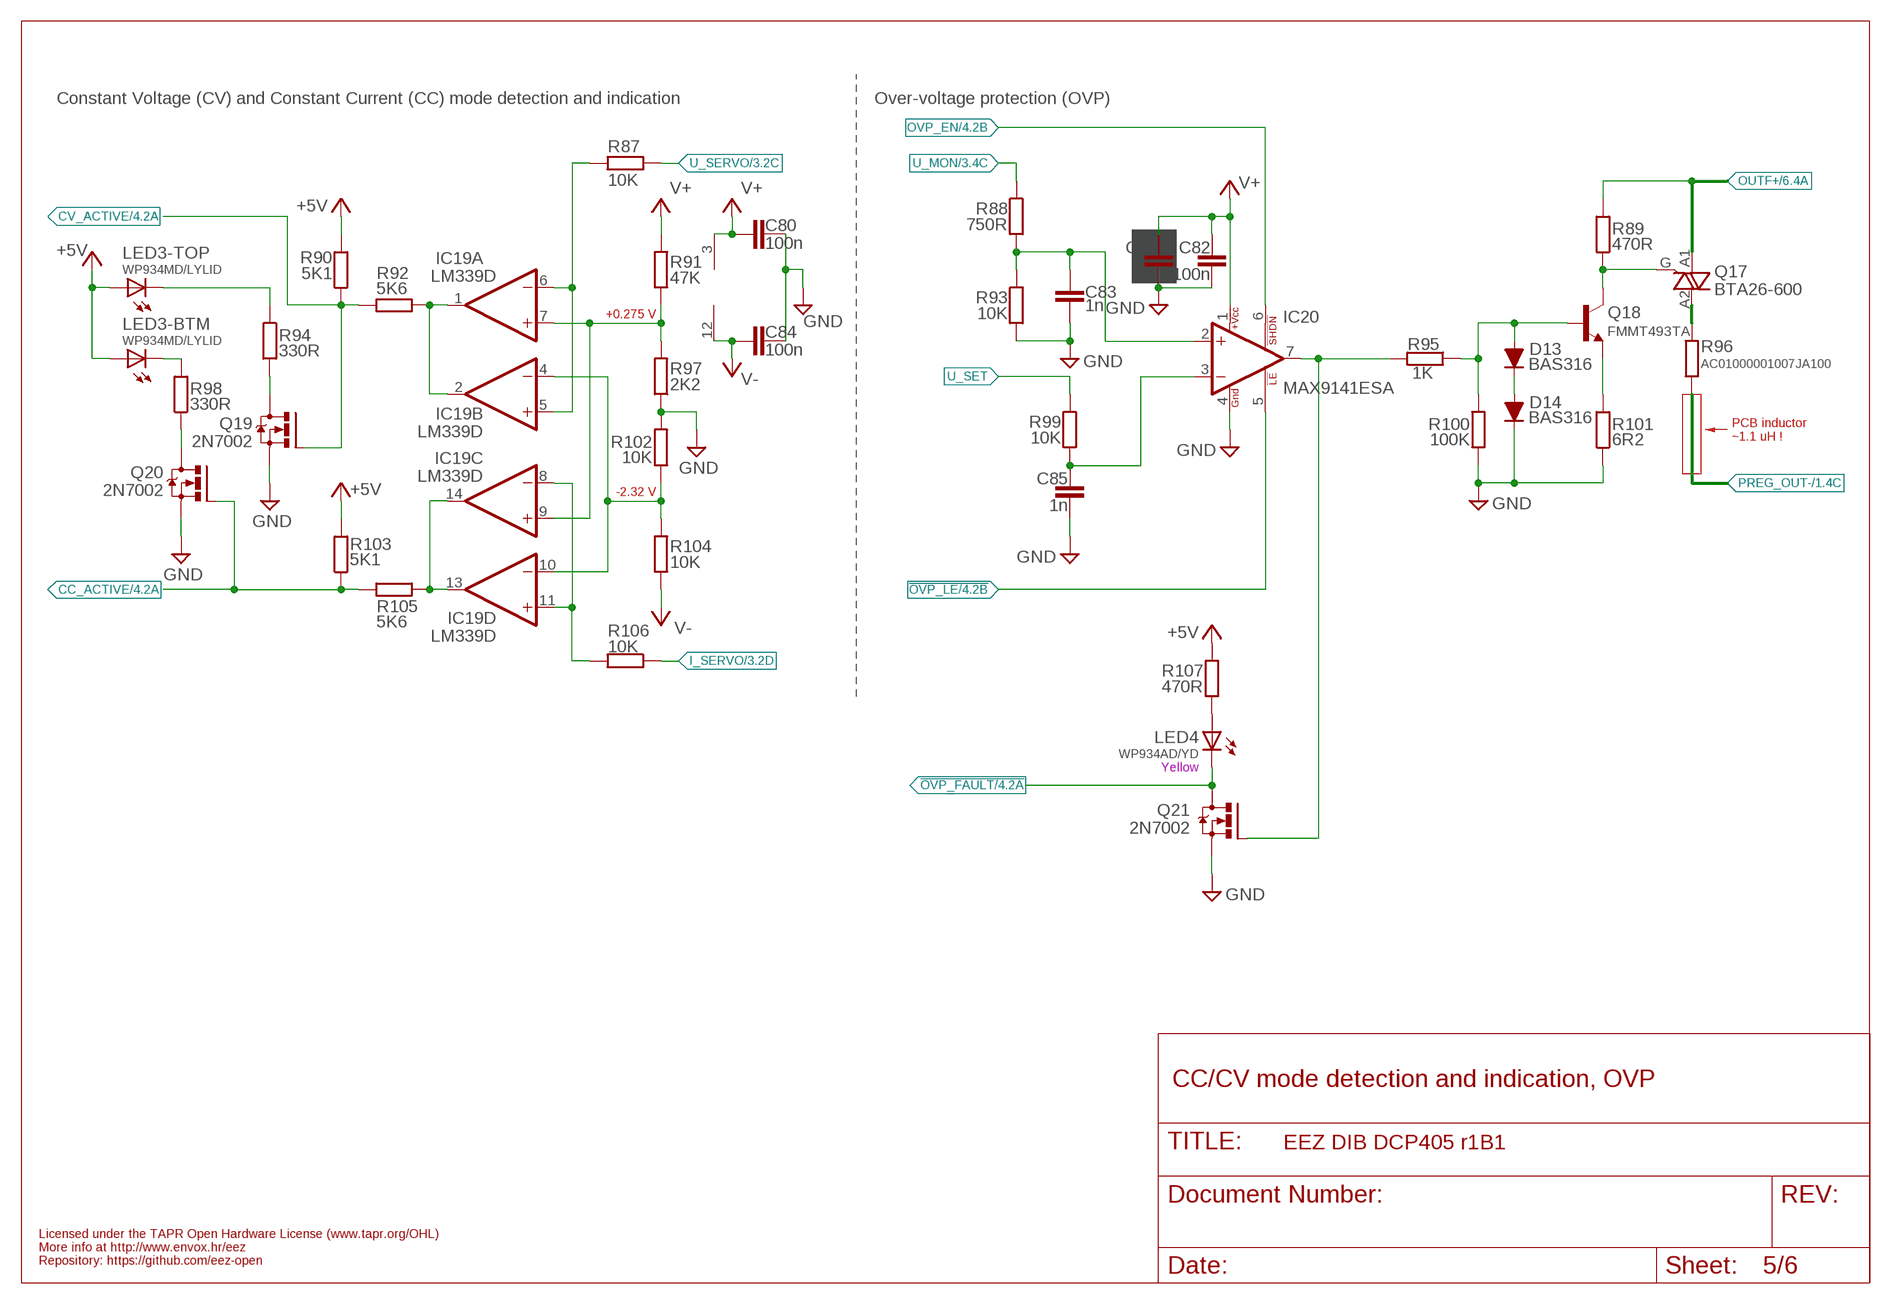
[diagram p4: schematic, sheet 5]

### Parts
C80  100n  C-EUC0603  [C0603]
C81  1u  C-EUC0805  [C0805]
C82  100n  C-EUC0603  [C0603]
C83  1n  C-EUC0805  [C0805]
C84  100n  C-EUC0603  [C0603]
C85  1n  C-EUC0805  [C0805]
D13  BAS316  DIODESOD323R  [SOD323-R]
D14  BAS316  DIODESOD323R  [SOD323-R]
IC19  LM339D  LM339SO14  [SOIC127P600X175-14N]
IC20  MAX9141ESA  [SOIC127P600X173-8N]
LED3  WP934MD/LYLID  [WP934MD]
LED4  WP934AD/YD  [WP934AD]
Q17  BTA26-600  BTA41-2  [TOP3_TRIAC_NOHOLE]
Q18  FMMT493TA  MMBT5551LT1-NPN-SOT23-BEC  [SOT23-BEC]
Q19  2N7002  [SOT103P240X110-3N]
Q20  2N7002  [SOT103P240X110-3N]
Q21  2N7002  [SOT103P240X110-3N]
R87  10K  R-EU_R0805  [R0805]
R88  750R  R-EU_R0805  [R0805]
R89  470R  R-EU_R0805  [R0805]
R90  5K1  R-EU_R0805  [R0805]
R91  47K  R-EU_R0805  [R0805]
R92  5K6  R-EU_R0805  [R0805]
R93  10K  R-EU_R0805  [R0805]
R94  330R  R-EU_R0805  [R0805]
R95  1K  R-EU_R0805  [R0805]
R96  AC01000001007JA100  R-EU_0411/15  [0411/15]
R97  2K2  R-EU_R0805  [R0805]
R98  330R  R-EU_R0805  [R0805]
R99  10K  R-EU_R0805  [R0805]
R100  100K  R-EU_R0805  [R0805]
R101  6R2  R-EU_R0805  [R0805]
R102  10K  R-EU_R0805  [R0805]
R103  5K1  R-EU_R0805  [R0805]
R104  10K  R-EU_R0805  [R0805]
R105  5K6  R-EU_R0805  [R0805]
R106  10K  R-EU_R0805  [R0805]
R107  470R  R-EU_R0805  [R0805]

### Nets
!OVP_FAULT: LED4.C Q21.3(D) ; also sheet 4
!OVP_LE: IC20.5(!LE) ; also sheet 4
+5V: LED3.BA(-BTM:A) LED3.TA(-TOP:A) R90.2 R103.2 R107.1 ; also sheet 2,3,4,6
CC_ACTIVE: Q20.1(G) R103.1 R105.2 ; also sheet 4
CC_LED: LED3.BC(-BTM:C) R98.2
CV_ACTIVE: Q19.1(G) R90.1 R92.2 ; also sheet 4
CV_LED: LED3.TC(-TOP:C) R94.1
GND: C80.1 C81.2 C82.1 C83.1 C84.1 C85.1 D14.C IC20.4(GND) Q19.2(S) Q20.2(S) Q21.2(S) R93.2 R97.1 R100.1 R101.1 R102.2 ; also sheet 1,2,3,4,6
I_SERVO: R106.1 ; also sheet 3
N$3: LED4.A R107.2
N$13: IC20.7(OUT) Q21.1(G) R95.2
N$15: Q17.A2 R96.2
N$18: Q17.G Q18.C R89.1
N$19: Q18.E R101.2
N$20: D13.C D14.A
N$21: D13.A Q18.B R95.1 R100.2
N$31: C85.2 IC20.3(-IN) R99.2
N$33: C83.2 IC20.2(+IN) R88.2 R93.1
N$46: Q20.3(D) R98.1
N$105: IC19.1(A:OUT) IC19.2(B:OUT) R92.1
N$106: IC19.13(D:OUT) IC19.14(C:OUT) R105.1
N$118: Q19.3(D) R94.2
N$153: IC19.5(B:+IN) IC19.6(A:-IN) R87.2
N$161: IC19.8(C:-IN) IC19.11(D:+IN) R106.2
N$170: IC19.7(A:+IN) IC19.9(C:+IN) R91.1 R97.2
N$177: IC19.4(B:-IN) IC19.10(D:-IN) R102.1 R104.2
OUTF+: Q17.A1 R89.2 ; also sheet 6
OVP_EN: IC20.6(!SHDN) ; also sheet 4
PREG_OUT-: R96.1 ; also sheet 1,3
U_MON: R88.1 ; also sheet 3,4
U_SERVO: R87.1 ; also sheet 3
U_SET: R99.1 ; also sheet 4
V+: C80.2 C81.1 C82.2 IC19.3(P:V+) IC20.1(+VCC) R91.2 ; also sheet 2,3,4
V-: C84.2 IC19.12(P:GND) R104.1 ; also sheet 2,3

### Notes on the sheet
- Constant Voltage (CV) and Constant Current (CC) mode detection and indication | Over-voltage protection (OVP)
- +0.275 V
- PCB inductor
  ~1.1 uH !
- -2.32 V
- Yellow
- CC/CV mode detection and indication, OVP
- Licensed under the TAPR Open Hardware License (www.tapr.org/OHL)
- More info at http://www.envox.hr/eez
- Repository: https://github.com/eez-open

## Sheet 6 of 6: Rsense protection, power output
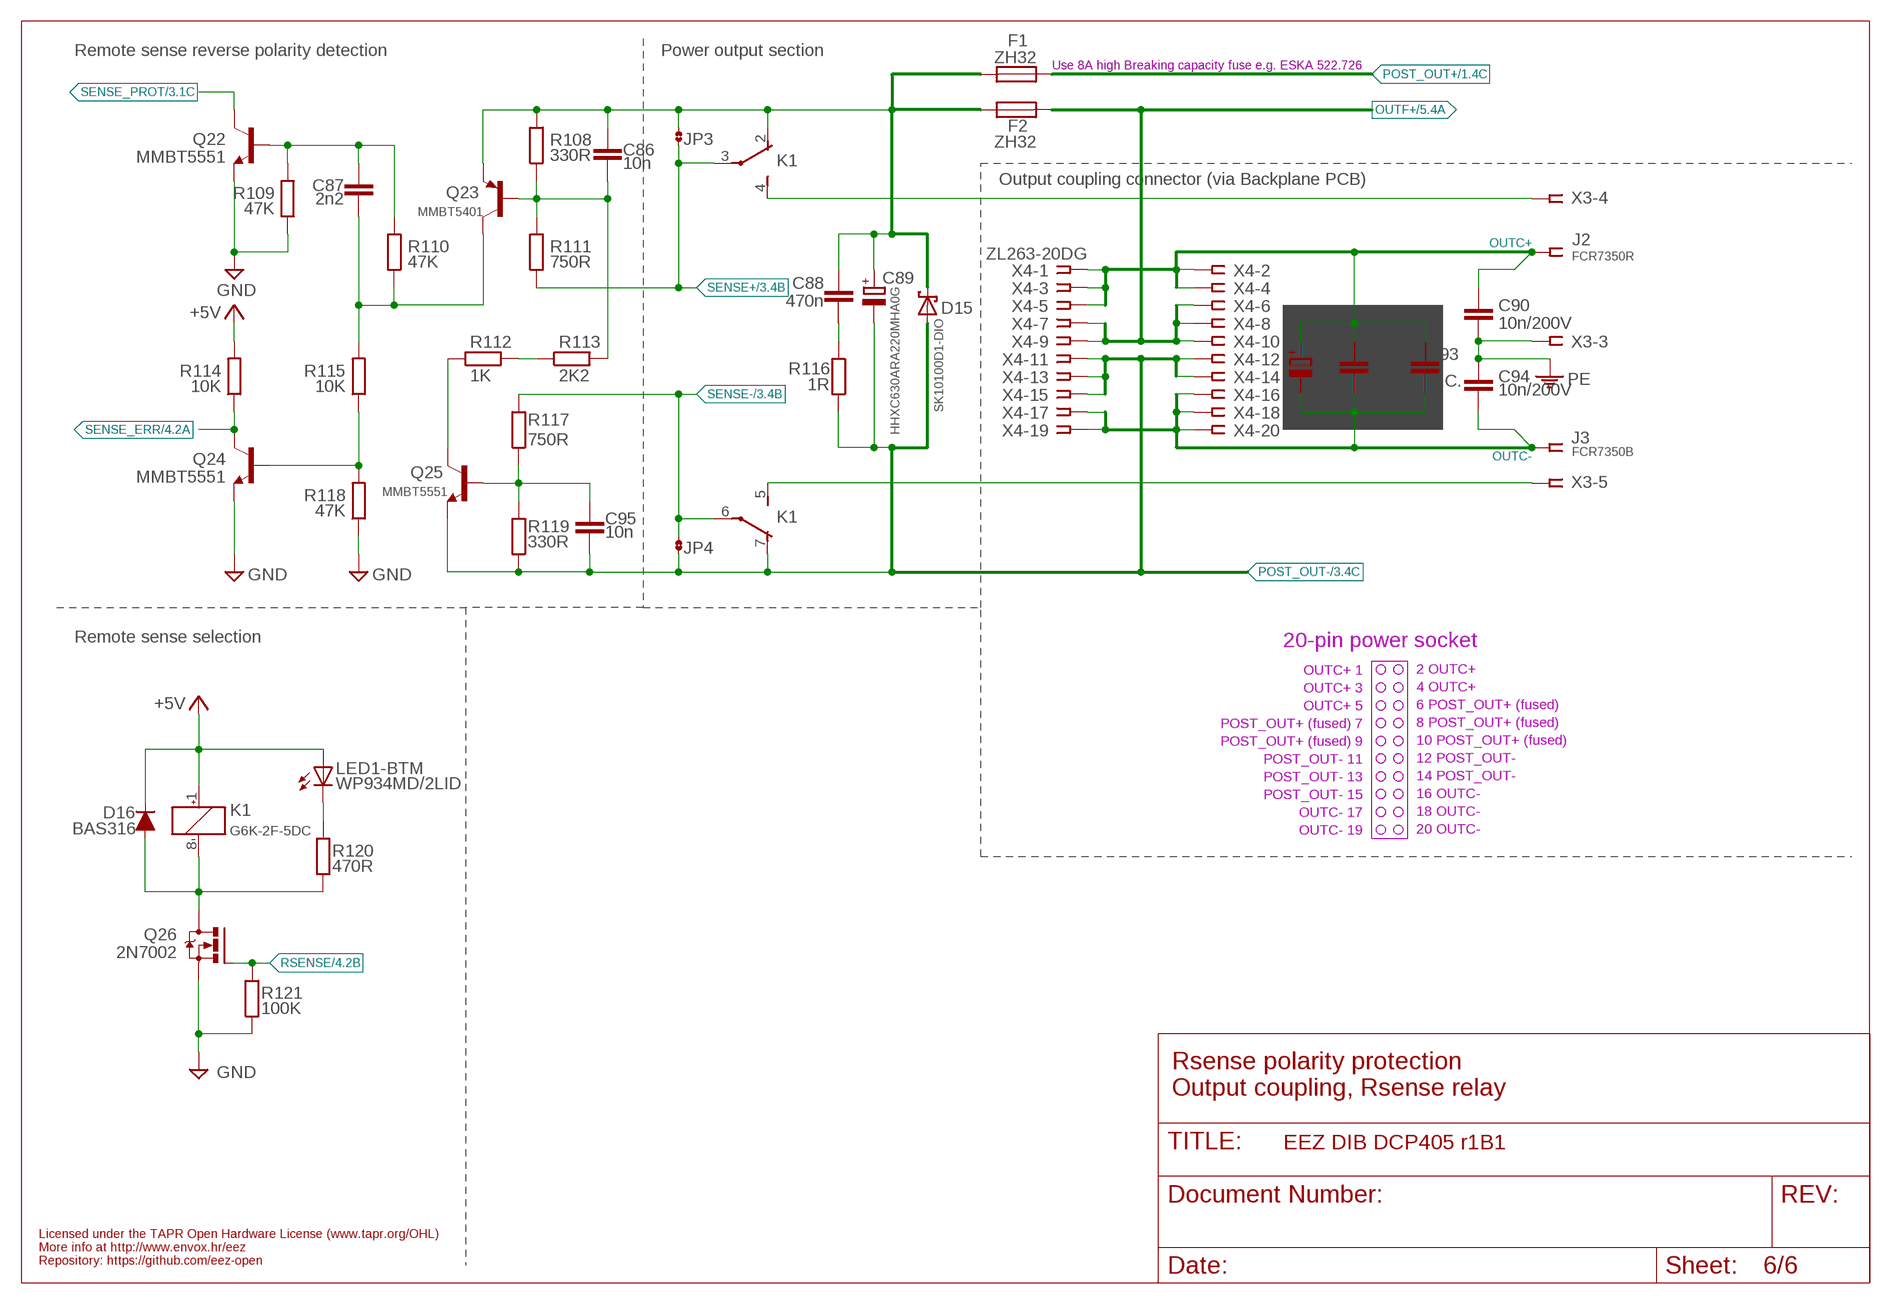
[diagram p5: schematic, sheet 6]

### Parts
C86  10n  C-EUC0805  [C0805]
C87  2n2  C-EUC0805  [C0805]
C88  470n  C-EUC1206  [C1206]
C89  HHXC630ARA220MHA0G  ECAPSMD8.3MM/HA0  [CAPAE830X1050N]
C90  10n/200V  C-EUC1206  [C1206]
C91  N.C.  ECAP2G/5  [ECAP2/5]
C92  N.C.  C-EUC0805  [C0805]
C93  N.C.  C-EUC0805  [C0805]
C94  10n/200V  C-EUC1206  [C1206]
C95  10n  C-EUC0805  [C0805]
D15  SK10100D1-DIO  SCHOTTKY-DUAL_A_L  [TO252-L]
D16  BAS316  DIODESOD323R  [SOD323-R]
F1  ZH32  [ZH32]
F2  ZH32  [ZH32]
J2  FCR7350R  BINDING_POSTCLIFF  [S16N-PC]
J3  FCR7350B  BINDING_POSTCLIFF  [S16N-PC]
JP3  JP2-CUT  [JP2-CUT]
JP4  JP2-CUT  [JP2-CUT]
K1  G6K-2F-5DC  G6K-2F  [G6K-2F]
Q22  MMBT5551  MMBT5551LT1-NPN-SOT23-BEC  [SOT23-BEC]
Q23  MMBT5401  BC857B-PNP-SOT23-BEC  [SOT23-BEC]
Q24  MMBT5551  MMBT5551LT1-NPN-SOT23-BEC  [SOT23-BEC]
Q25  MMBT5551  MMBT5551LT1-NPN-SOT23-BEC  [SOT23-BEC]
Q26  2N7002  [SOT103P240X110-3N]
R108  330R  R-EU_R0805  [R0805]
R109  47K  R-EU_R0805  [R0805]
R110  47K  R-EU_R0805  [R0805]
R111  750R  R-EU_R0805  [R0805]
R112  1K  R-EU_R0805  [R0805]
R113  2K2  R-EU_R0805  [R0805]
R114  10K  R-EU_R0805  [R0805]
R115  10K  R-EU_R0805  [R0805]
R116  1R  R-EU_R0805  [R0805]
R117  750R  R-EU_R0805  [R0805]
R118  47K  R-EU_R0805  [R0805]
R119  330R  R-EU_R0805  [R0805]
R120  470R  R-EU_R0805  [R0805]
R121  100K  R-EU_R0805  [R0805]
X4  ZL263-20DG  SSW-110-02-T-D-RA  [SSW-110-02-T-D-RA]

### Nets
+5V: D16.C K1.1(1:+) LED1.BA(-BTM:A) R114.2 ; also sheet 2,3,4,5
GND: Q22.E Q24.E Q26.2(S) R109.1 R118.1 R121.1 ; also sheet 1,2,3,4,5
N$107: C86.2 Q23.B R108.1 R111.2 R113.2
N$108: C87.2 Q23.C R110.1 R115.2
N$109: Q25.C R112.1
N$110: C95.1 Q25.B R117.1 R119.2
N$111: C87.1 Q22.B R109.2 R110.2
N$112: Q24.B R115.1 R118.2
N$113: C88.2 R116.2
N$114: D16.A K1.8(1:-) Q26.3(D) R120.1
N$115: K1.4(2:S) X3.4
N$116: K1.5(3:S) X3.5
N$120: LED1.BC(-BTM:C) R120.2
N$173: R112.2 R113.1
OUTC+: C90.1 C91.+ C92.1 C93.1 J2.1 J2.NC1 J2.NC2 J2.NC3 J2.NC4 X4.1 X4.2 X4.3 X4.4 X4.5
OUTC-: C91.- C92.2 C93.2 C94.2 J3.1 J3.NC1 J3.NC2 J3.NC3 J3.NC4 X4.16 X4.17 X4.18 X4.19 X4.20
OUTF+: F2.2 X4.6 X4.7 X4.8 X4.9 X4.10 ; also sheet 5
PE: C90.2 C94.1 X3.3 ; also sheet 1
POST_OUT+: F1.1 ; also sheet 1,3
POST_OUT-: C89.- C95.2 D15.1(A) D15.2(A) JP4.1 K1.7(3:O) Q25.E R116.1 R119.1 X4.11 X4.12 X4.13 X4.14 X4.15 ; also sheet 3
POST_OUTF+: C86.1 C88.1 C89.+ D15.3(C) F1.2 F2.1 JP3.2 K1.2(2:O) Q23.E R108.2
RSENSE: Q26.1(G) R121.2 ; also sheet 4
SENSE+: JP3.1 K1.3(2:P) R111.1 ; also sheet 3
SENSE-: JP4.2 K1.6(3:P) R117.2 ; also sheet 3
SENSE_ERR: Q24.C R114.1 ; also sheet 4
SENSE_PROT: Q22.C ; also sheet 3

### Notes on the sheet
- Remote sense reverse polarity detection | Power output section
- Use 8A high Breaking capacity fuse e.g. ESKA 522.726
- Output coupling connector (via Backplane PCB)
- Remote sense selection | 20-pin power socket
- OUTC+ 1
- 2 OUTC+
- OUTC+ 3
- 4 OUTC+
- OUTC+ 5
- 6 POST_OUT+ (fused)
- POST_OUT+ (fused) 7
- 8 POST_OUT+ (fused)
- POST_OUT+ (fused) 9
- 10 POST_OUT+ (fused)
- POST_OUT- 11
- 12 POST_OUT-
- POST_OUT- 13
- 14 POST_OUT-
- POST_OUT- 15
- 16 OUTC-
- OUTC- 17
- 18 OUTC-
- OUTC- 19
- 20 OUTC-
- Rsense polarity protection
  Output coupling, Rsense relay
- Licensed under the TAPR Open Hardware License (www.tapr.org/OHL)
- More info at http://www.envox.hr/eez
- Repository: https://github.com/eez-open

## Library data of the parts
C1 C3-C13 C16-C19 C21 C23-C26 C28-C33 C35-C65 C67-C88 C90 C92-C95 = rcl:C-EU: CAPACITOR, European symbol
C2 C14 C15 C22 C27 C34 C66 C89 C91 = EEZ_Lib1:ECAP
C20 = rcl:CPOL-EU: POLARIZED CAPACITOR, European symbol
D1 D3-D10 D12-D14 D16 = EEZ_Lib1:DIODE
D2 D11 D15 = EEZ_Lib1:SCHOTTKY
F1 F2 = EEZ_Lib1:ZH32: Fuse holder with cover; tube fuses; 5x20mm
FB1-FB3 = EEZ_Lib1:FERRITE_BEAD: FAIR-RITE - 2506033007Y3 - FERRITE BEAD, 0.04OHM, 3A, 0603 Farnell: 2112873
FM1 FM2 = EEZ_Lib1:FIDUCIAL: Fiducial mark for pick and place automation
IC1 = EEZ_Lib1:LTC3864: 60V Low Iq Step-Down DC/DC Controller with 100% Duty Cycle Capability
IC2 = EEZ_Lib1:TL783: REG, HI-VOLT, ADJ, D2PAK-3
IC3 = EEZ_Lib1:LP2951: LP2950-N/LP2951-N Series of Adjustable Micropower Voltage Regulators
IC4 IC7 = EEZ_Lib1:SI8641: Low power 4-ch digital isolator (3+1) Farnell: 2423288
IC5 = EEZ_DIB:SN74LVC1G139: 2-to-4 Line Decoder
IC6 = EEZ_Lib1:LTC3260: Low Noise Dual Supply Inverting Charge Pump
IC8 = EEZ_Lib1:AT24CXX: I2C-Compatible (2-wire) Serial EEPROM
IC9 = EEZ_Lib1:TMPX75: Temperature Sensor With I2C and SMBus Interface
IC10 IC11 = EEZ_Lib1:TL072
IC12 = EEZ_Lib1:OP27GSZ: Low Noise, Precision Operational Amplifier
IC13 = EEZ_Lib1:SN74LVC1G74DCTR: Single Positive-Edge-Triggered D-Type Flip-Flop with Clear and Preset
IC14 = EEZ_Lib1:MCP23S17-E/SS: 16-Bit I/O Expander with Serial Interface; FARNELL: 1467675; TME: MCP23S17-E/SS
IC15 = EEZ_Lib1:REF50XX: Low-Noise (3μVpp/V), Very Low Drift (max. 8ppm/°C), Precision Voltage Reference Pin compatible with REF2 Farnell: 1439628
IC16 = EEZ_Lib1:DAC8552_DGK_8
IC17 = EEZ_Lib1:SN74LVC1G3157
IC18 = EEZ_Lib1:ADS1120: Low-Power, Low-Noise, 16-Bit, Analog-to-Digital Converter for Small-Signal Sensors Farnell: 2402249
IC19 = EEZ_Lib1:LM339: Low Power Low Offset Voltage Quad Comparators with open collector; LM139/LM239/LM339/LM2901/LM3302
IC20 = EEZ_Lib1:MAX9141: 40ns, Low-Power, 3V/5V, Rail-to-Rail Single-Supply Comparator
J1 = EEZ_connectors:PCB_TAB: PCB quick-fit terminal
J2 J3 = EEZ_Lib1:BINDING_POST: Various 4 mm binding posts
JP1-JP4 = EEZ_Lib1:JP2-CUT
K1 = relay:G6K: Low Signal Relay oeiwcsnts1.omron.com/.. D20G6K0100.pdf; MF: OMRON COMPONENTS USA; MPN: G6K-2F DC24; OC_FARNELL: 1690427; OC_NEWARK: 36K7467
KK1 KK2 = EEZ_Lib1:PCB-MB: Richo Mounting Block; 16 x 6 mm
L1 = EEZ_Lib1:RN112
L2 = EEZ_inductors_and_transformers:125CDMCC/DS: Sumida SMD power inductor 13.8×12.9×5.0mm
L3 L4 = EEZ_inductors_and_transformers:COILCRAFT_HPI0630: High power inductor
LED1 LED3 = EEZ_Lib1:WP934MD: Kingbright LED; in housing; 3mm; No.of diodes:2
LED2 = EEZ_Lib1:LED_L-42WUM/1EGWT: 3 mm right angle bicolor LED indicator
LED4 = EEZ_Lib1:WP934AD: Kingbright LED; in housing; 3mm
Q1 Q6 = EEZ_Lib1:P-MOSFET: HEXFET Power MosFet Source: http://www.irf.com/
Q2 Q4 Q8 Q9 Q23 = transistor:*-PNP-: PNP Transistror
Q3 = EEZ_Lib1:IRFP240: N-channel MOSFET (TO-247)
Q5 Q7 = EEZ_Lib1:BCP56: Low power NPN Transistor, Vceo=80V, Ic=1A, SOT-223
Q10 Q11 Q18 Q22 Q24 Q25 = transistor:*-NPN-: NPN Transistror BF959 corrected 2008.03.06
Q12-Q14 = EEZ_Lib1:N-MOSFET
Q15 Q19-Q21 Q26 = EEZ_Lib1:2N7002: N-CHANNEL ENHANCEMENT MODE FIELD EFFECT TRANSISTOR; MPN: 2N7002-7-F; OC_FARNELL: 1713823; OC_NEWARK: 25R5679; PACKAGE: SOT-23-3; SUPPLIER: DIODES INC.
Q16 = EEZ_Lib1:IRLML2246TRPBF: HEXFET Power MOSFET (-20V, -2.6A); MPN: IRLML2246TRPBF; OC_FARNELL: 1888166; OC_NEWARK: 40T7450; PACKAGE: SOT-3; SUPPLIER: International Rectifier; TME: IRLML2246TRPBF
Q17 = EEZ_Lib1:BTA41: Triac; 40A; 50mA; THT; TOP3
R1-R70 R72-R121 = rcl:R-EU_: RESISTOR, European symbol
R71 = EEZ_Lib1:R-EU_4WIRE
RN1 RN2 = EEZ_Lib1:R_ARRAY4: 1206 four resistor array
SH1-SH3 = EEZ_Lib1:SHORT
TP1 TP2 = EEZ_Lib1:PCB_TEST_TAB
X1 = EEZ_connectors:MINIFIT_39301020: Molex Socket; wire-board; male; Mini-Fit Jr; 4.2mm; PIN:2; THT; PCB snap
X2 = EEZ_connectors:M20-9701346: Harwin 0.1" 13+13 pin header
X3 = EEZ_connectors:MC1,5/5-G-3,5: Pluggable Terminal Blocks 5-pin 3.5mm pitch Through Hole Header
X4 = EEZ_connectors:SSW-110-02-T-D-RA: Samtec SSW-113-02-T-D-RA Receptacle, 2.54MM, RA, 20-way
ZD1 = EEZ_Lib1:P6SMB68A: Transient Voltage Suppression Diodes, DO-214AA
ZD2-ZD4 = EEZ_Lib1:ZENER-DIODE
ZD5 = EEZ_Lib1:SLVU2.8: 2.8Volts ESD Protection Devices

## Net classes
0 default: width 0.203 mm, drill 0.3 mm, clearance 0.203 mm
1 lvds: width 0.152 mm, drill 0.3 mm, clearance 0.152 mm to class 0, clearance 0.152 mm
2 gnd: width 0.254 mm, drill 0.584 mm, clearance 0.254 mm